# Altium schematic sheet Analog_protections.SchDoc: Overvoltage_protection
size A4; CheckedBy: Hildo / Joel / Luis; Author: Fellipe; Organization: UNICAMP / LCEE; Address1: University of Campinas - Brazil; Address2: Power Conditioning Laboratory; Address3: Licensed by GNU GPL 3.0; ProjectName: Easy Inverter
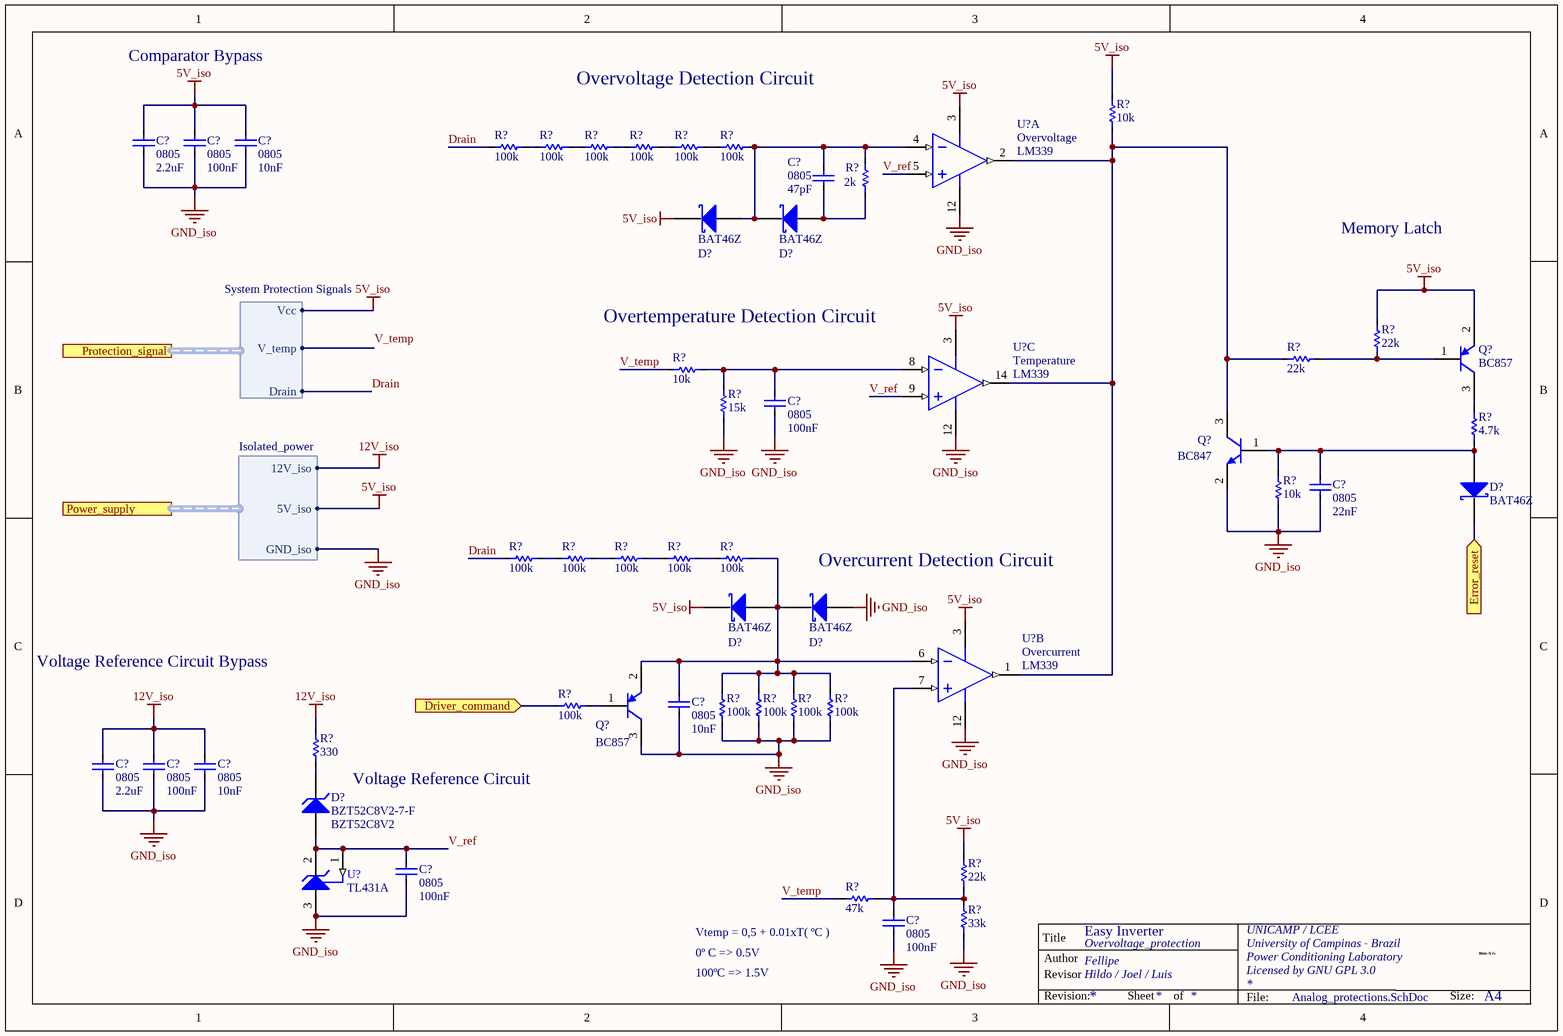
[diagram p0: Analog_protections.SchDoc]

## Parts
(Parts that share a designator on the sheet are numbered #1, #2 ... from top to bottom, then left to right.)
C?#1  0805  value 2.2uF  [Capacitor 0805]
C?#2  0805  value 100nF  [Capacitor 0805]
C?#3  0805  value 10nF  [Capacitor 0805]
C?#4  0805  value 47pF  [Capacitor 0805]
C?#5  0805  value 100nF  [Capacitor 0805]
C?#6  0805  value 22nF  [Capacitor 0805]
C?#7  0805  value 10nF  [Capacitor 0805]
C?#8  0805  value 2.2uF  [Capacitor 0805]
C?#9  0805  value 100nF  [Capacitor 0805]
C?#10  0805  value 10nF  [Capacitor 0805]
C?#11  0805  value 100nF  [Capacitor 0805]
C?#12  0805  value 100nF  [Capacitor 0805]
D?#1  BAT46Z  [SOD 123]
D?#2  BAT46Z  [SOD 123]
D?#3  BAT46Z  [SOD 123]
D?#4  BAT46Z  [SOD 123]
D?#5  BAT46Z  [SOD 123]
D?#6  BZT52C8V2-7-F  value BZT52C8V2  [SOD 123]
Q?#1  BC857  [SOT 23]
Q?#2  BC847  [SOT 23]
Q?#3  BC857  [SOT 23]
R?#1  value 10k  [Resistor 0805]  (hidden comment: Resistor 0805)
R?#2  value 100k  [Resistor 0805]  (hidden comment: Resistor 0805)
R?#3  value 100k  [Resistor 0805]  (hidden comment: Resistor 0805)
R?#4  value 100k  [Resistor 0805]  (hidden comment: Resistor 0805)
R?#5  value 100k  [Resistor 0805]  (hidden comment: Resistor 0805)
R?#6  value 100k  [Resistor 0805]  (hidden comment: Resistor 0805)
R?#7  value 100k  [Resistor 0805]  (hidden comment: Resistor 0805)
R?#8  value 2k  [Resistor 0805]  (hidden comment: Resistor 0805)
R?#9  value 22k  [Resistor 0805]  (hidden comment: Resistor 0805)
R?#10  value 22k  [Resistor 0805]  (hidden comment: Resistor 0805)
R?#11  value 10k  [Resistor 0805]  (hidden comment: Resistor 0805)
R?#12  value 15k  [Resistor 0805]  (hidden comment: Resistor 0805)
R?#13  value 4.7k  [Resistor 0805]  (hidden comment: Resistor 0805)
R?#14  value 10k  [Resistor 0805]  (hidden comment: Resistor 0805)
R?#15  value 100k  [Resistor 0805]  (hidden comment: Resistor 0805)
R?#16  value 100k  [Resistor 0805]  (hidden comment: Resistor 0805)
R?#17  value 100k  [Resistor 0805]  (hidden comment: Resistor 0805)
R?#18  value 100k  [Resistor 0805]  (hidden comment: Resistor 0805)
R?#19  value 100k  [Resistor 0805]  (hidden comment: Resistor 0805)
R?#20  value 100k  [Resistor 0805]  (hidden comment: Resistor 0805)
R?#21  value 100k  [Resistor 0805]  (hidden comment: Resistor 0805)
R?#22  value 100k  [Resistor 0805]  (hidden comment: Resistor 0805)
R?#23  value 100k  [Resistor 0805]  (hidden comment: Resistor 0805)
R?#24  value 100k  [Resistor 0805]  (hidden comment: Resistor 0805)
R?#25  value 330  [Resistor 0805]  (hidden comment: Resistor 0805)
R?#26  value 22k  [Resistor 0805]  (hidden comment: Resistor 0805)
R?#27  value 47k  [Resistor 0805]  (hidden comment: Resistor 0805)
R?#28  value 33k  [Resistor 0805]  (hidden comment: Resistor 0805)
U?#1  Overvoltage  value LM339  [SOIC 14]  (part A of 4)
U?#2  Temperature  value LM339  [SOIC 14]  (part C of 4)
U?#3  Overcurrent  value LM339  [SOIC 14]  (part B of 4)
U?#4  TL431A  [SOT 23]

## Ports
Driver_command (in), Error_reset (in), Power_supply (harness Isolated_power), Protection_signal (harness System Protection Signals)

## Harnesses
System Protection Signals: Drain, V_temp, Vcc
Isolated_power: GND_iso, 5V_iso, 12V_iso

## Nets
5V_iso: C?#1.1 C?#2.1 C?#3.1 D?#1.2(K) D?#4.2(K) Q?#1.2(E) R?#1.2 R?#9.2 R?#26.2 U?#1.3(V+) U?#2.3(V+) U?#3.3(V+) ; port Protection_signal.Vcc, port Power_supply.5V_iso
12V_iso: C?#8.1 C?#9.1 C?#10.1 R?#25.2 ; port Power_supply.12V_iso
GND_iso: C?#1.2 C?#2.2 C?#3.2 C?#5.2 C?#6.2 C?#7.2 C?#8.2 C?#9.2 C?#10.2 C?#11.2 C?#12.2 D?#5.1(A) Q?#2.2(E) Q?#3.3(C) R?#12.1 R?#14.1 R?#21.1 R?#22.1 R?#23.1 R?#24.1 R?#28.1 U?#1.12(GND) U?#2.12(GND) U?#3.12(GND) U?#4.3(ANODE) ; port Power_supply.GND_iso
Drain: R?#2.1 R?#15.1 ; port Protection_signal.Drain
Driver_command: R?#20.2 ; port Driver_command
Error_reset: D?#3.2(K) ; port Error_reset
V_ref: C?#11.1 D?#6.1(A) U?#1.5(IN1+) U?#2.9(IN3+) U?#4.1(REF) U?#4.2(CATHODE)
V_temp: R?#11.1 R?#27.1
NetC?#4_1: C?#4.1 D?#1.1(A) D?#2.2(K) R?#7.2 R?#8.2 U?#1.4(IN1-)
NetC?#4_2: C?#4.2 D?#2.1(A) R?#8.1
NetC?#5_1: C?#5.1 R?#11.2 R?#12.2 U?#2.8(IN3-)
NetC?#6_1: C?#6.1 D?#3.1(A) Q?#2.1(B) R?#13.1 R?#14.2
NetC?#7_1: C?#7.1 D?#4.1(A) D?#5.2(K) Q?#3.2(E) R?#19.2 R?#21.2 R?#22.2 R?#23.2 R?#24.2 U?#3.6(IN2-)
NetC?#12_1: C?#12.1 R?#26.1 R?#27.2 R?#28.2 U?#3.7(IN2+)
NetD?#6_2: D?#6.2(K) R?#25.1
NetQ?#1_1: Q?#1.1(B) R?#9.1 R?#10.2
NetQ?#1_3: Q?#1.3(C) R?#13.2
NetQ?#2_3: Q?#2.3(C) R?#1.1 R?#10.1 U?#1.2(OUT1) U?#2.14(OUT3) U?#3.1(OUT2)
NetQ?#3_1: Q?#3.1(B) R?#20.1
NetR?#2_2: R?#2.2 R?#3.1
NetR?#3_2: R?#3.2 R?#4.1
NetR?#4_2: R?#4.2 R?#5.1
NetR?#5_2: R?#5.2 R?#6.1
NetR?#6_2: R?#6.2 R?#7.1
NetR?#15_2: R?#15.2 R?#16.1
NetR?#16_2: R?#16.2 R?#17.1
NetR?#17_2: R?#17.2 R?#18.1
NetR?#18_2: R?#18.2 R?#19.1

## Notes on the sheet
- Comparator Bypass
- Overvoltage Detection Circuit
- Memory Latch
- Overtemperature Detection Circuit
- (near D?#5) Overcurrent Detection Circuit
- Voltage Reference Circuit Bypass
- Voltage Reference Circuit
- Vtemp = 0,5 + 0.01xT( ºC )
- 0º C => 0.5V
- 100ºC => 1.5V
- Labels drawn without touching a wire or pin: V_temp
- Title
- Author
- Revisor
- Hildo G Jr
- Revision:
- Sheet
- of
- File:
- Size:
- A4
- HGJr

## Library data of the parts
C?#1-C?#12 = Capacitor 0805: SMD ceramic capacitor 0805; pn: undefined
D?#1-D?#5 = BAT46Z: DIODE SCHOTTKY 100V 150MA SOD123; pn: BAT46ZFILM; Value: BAT46Z
D?#6 = BZT52C8V2-7-F: DIODE ZENER 8.2V 500MW SOD123; pn: BZT52C8V2-7-F
Q?#1 Q?#3 = BC857BLT1G: General Purpose Transistor, PNP Silicon, 3-Pin SOT-23, Pb-Free, Tape and Reel; PN: BC857BLT1G; Value: BC857
Q?#2 = BC847BLT1G: General Purpose Transistor, NPN Silicon, 3-Pin SOT-23, Pb-Free, Tape and Reel; PN: BC847BLT1G; Value: BC847
R?#1-R?#28 = Resistor 0805: SMD resistor 0805; pn: undefined
U?#1-U?#3 = LM339: Low Power Low Offset Voltage Quad Comparator, 14-pin Narrow SOIC; PN: LM339DT
U?#4 = TL431A: IC VREF SHUNT ADJ SOT23-3; pn: TL431AMFDT\,215; ComponentLink1Description: Manufacturer URL; ComponentLink1URL: http://www.ti.com/; ComponentLink2Description: Datasheet; ComponentLink2URL: http://www.ti.com/general/docs/lit/getliterature.tsp?genericPartNumber=TL431A&fileType=pdf; Parameter 2: TL431A